# Altium schematic sheet TankBoardSheet4.SchDoc
size A
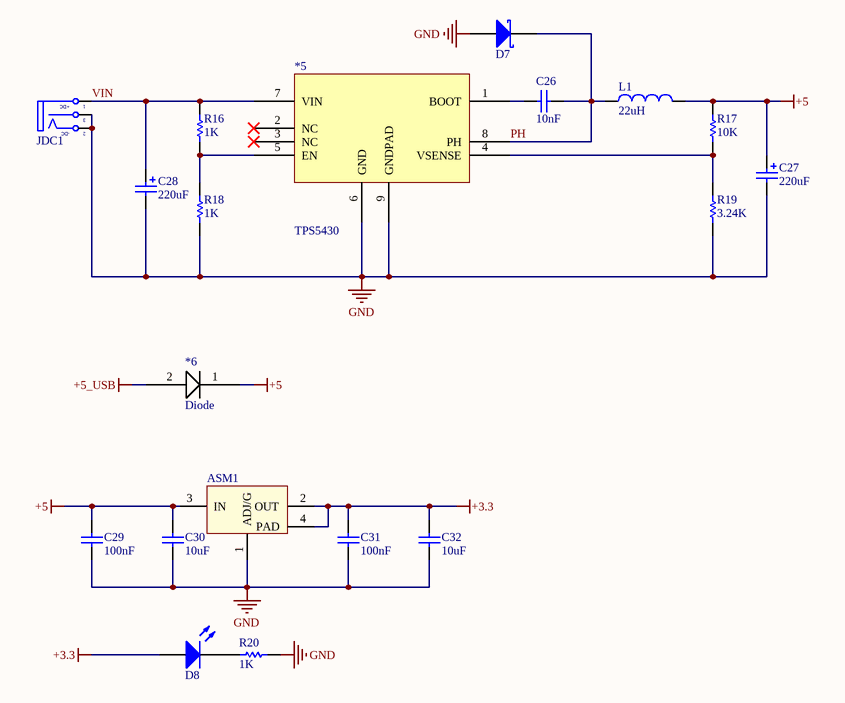
[diagram p0: TankBoardSheet4.SchDoc]

## Parts
*5  TPS5430  [SOIC127P600X170_HS-9N]
*6  Diode  [DIODE SMA (DO-214AC)]
ASM1  LM1117  [SOT223-4N]  (value not drawn)
C26  value 10nF  [CAP-SM-0603]  (hidden comment: Cap Non-Pol SMD)
C27  value 220uF  [CAP ALU SIZE D]  (hidden comment: Cap Pol SMD)
C28  value 220uF  [CAP ALU SIZE D]  (hidden comment: Cap Pol SMD)
C29  value 100nF  [CAP-SM-0603]  (hidden comment: Cap Non-Pol SMD)
C30  value 10uF  [CAP-SM-0603]  (hidden comment: Cap Non-Pol SMD)
C31  value 100nF  [CAP-SM-0603]  (hidden comment: Cap Non-Pol SMD)
C32  value 10uF  [CAP-SM-0603]  (hidden comment: Cap Non-Pol SMD)
D7  D Schottky  [SS34]  (value not drawn)
D8  LED SMD  [LED_0603_Blue]  (value not drawn)
JDC1  Jack DC  [DC-IN]  (value not drawn)
L1  value 22uH  [INDUCTOR 12.5x12.5]  (hidden comment: Inductor)
R16  value 1K  [RES-SM-0603]  (hidden comment: RESISTOR SMD)
R17  value 10K  [RES-SM-0603]  (hidden comment: RESISTOR SMD)
R18  value 1K  [RES-SM-0603]  (hidden comment: RESISTOR SMD)
R19  value 3.24K  [RES-SM-0603]  (hidden comment: RESISTOR SMD)
R20  value 1K  [RES-SM-0603]  (hidden comment: RESISTOR SMD)

## Nets
+3.3: ASM1.2(OUT) ASM1.4(PAD) C31.1 C32.1 D8.1(A)
+5: *6.1 ASM1.3(IN) C27.1 C29.1 C30.1 L1.2 R17.2
+5_USB: *6.2
GND: *5.6(GND) *5.9(GNDPAD) ASM1.1(ADJ/G) C27.2 C28.2 C29.2 C30.2 C31.2 C32.2 D7.1(A) JDC1.2(TN) JDC1.3(S) R18.1 R19.1 R20.1
PH: *5.8(PH) C26.1 D7.2(K) L1.1
VIN: *5.7(VIN) C28.1 JDC1.1(T) R16.2
Net*5_1: *5.1(BOOT) C26.2
Net*5_4: *5.4(VSENSE) R17.1 R19.2
Net*5_5: *5.5(EN) R16.1 R18.2
NetD8_2: D8.2(K) R20.2

Not connected (* = marked no-connect by the designer): *5 2(NC)* 3(NC)*

## Notes on the sheet
- (in symbol Jack DC) +DC; -DC

## Library data of the parts
ASM1 = LM1117: Available in 1.8V, 2.5V, 2.85V, 3.3V, 5V, and  Adjustable Versions; Value: LM317
C26 C29-C32 = Cap Non-Pol SMD: Capacitor
C27 C28 = Cap Pol SMD: Polarized Capacitor (Radial)
D7 = D Schottky: Schottky Diode; Published: 8-Jun-2000; LatestRevisionDate: 17-Jul-2002; LatestRevisionNote: Re-released for DXP Platform.; PackageReference: SMB; Publisher: Altium Limited; PackageDescription: DO-214-AA/SMB; 2 C-Bend Leads; Body 5.3 x 3.6 mm, inc. leads (LxW); Code_JEDEC: DO-214-AA
D8 = LED SMD: LED
JDC1 = Jack DC: Jack DC input; Value: Jac DC
R16-R20 = RESISTOR SMD: Resistor